# EasyEDA Pro project R标哨兵小周边 v1.1.epro

# Schematic Schematic2
Board Name: 上板; Create Date: 2024-09-23; Page Name: P1; Project Name: 新生培训——pcb入门（装甲板小周边）; Schematic Name: Schematic2; Update Date: 2024-09-23; Company: 嘉立创EDA; Page Size: A4; Version: V1.0
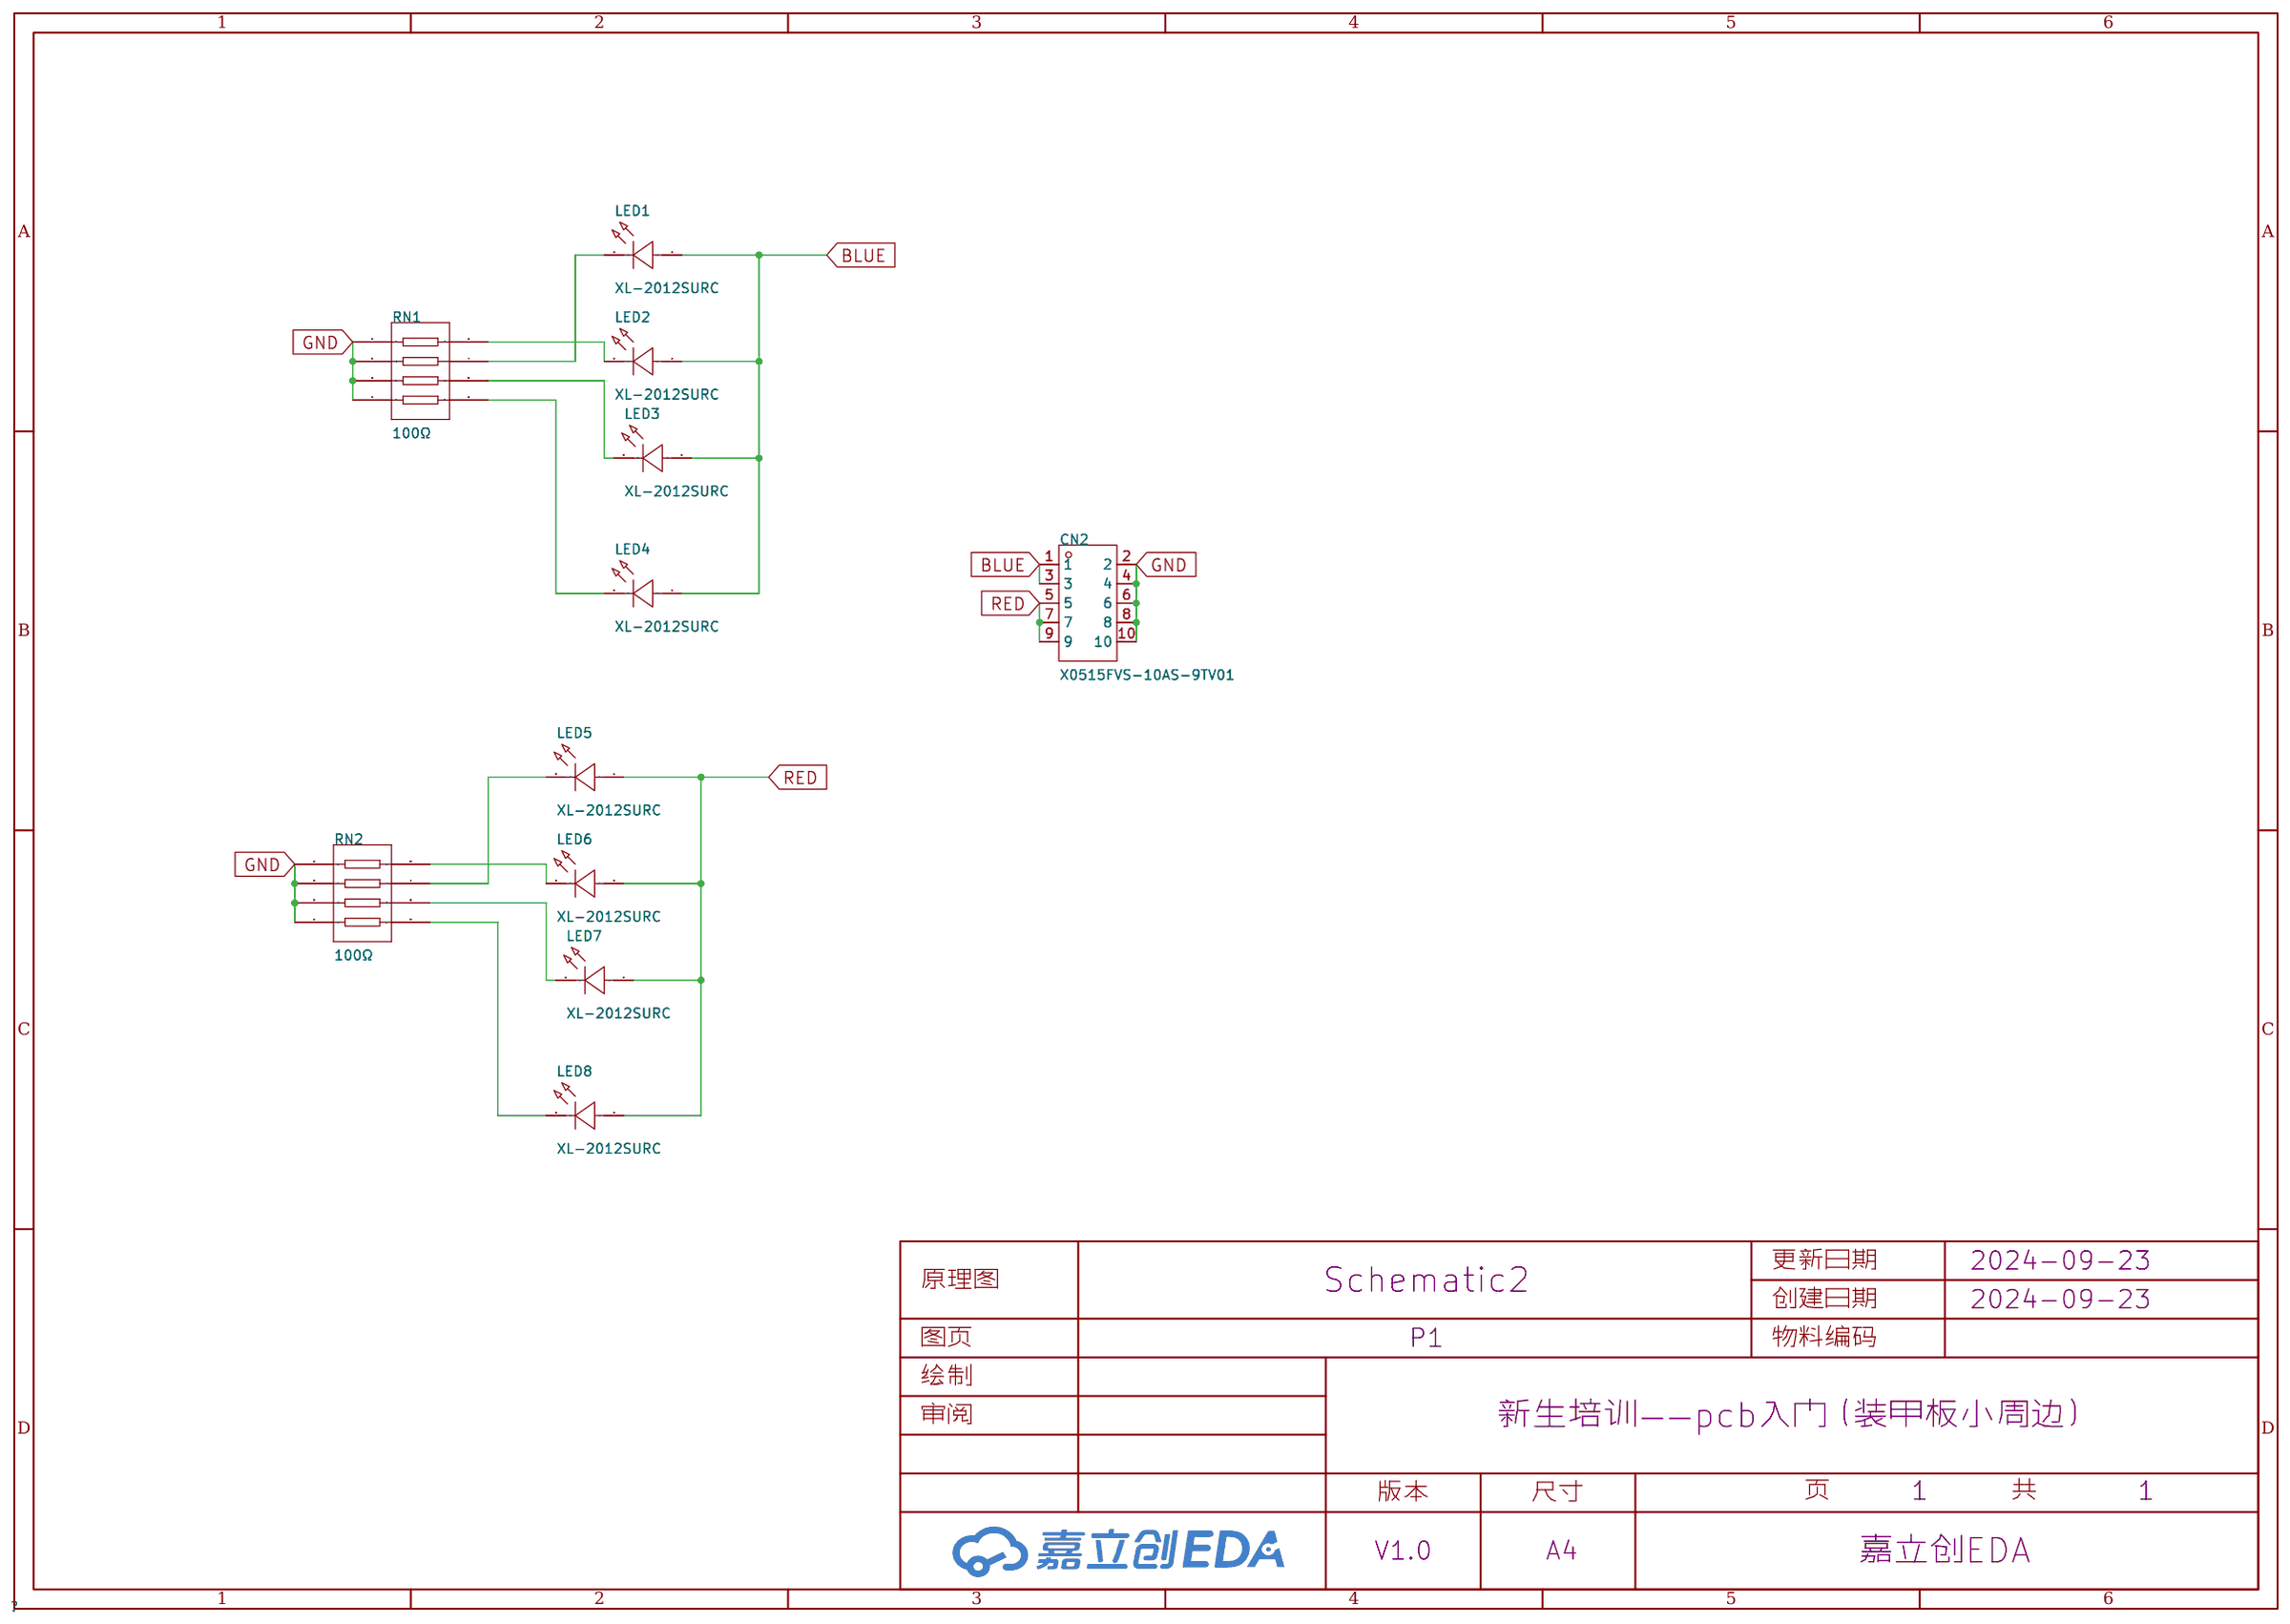
[diagram p0: schematic sheet]

## Parts
CN2  X0515FVS-10AS-9TV01  [CONN-SMD_10P-P0.50_XKB_X0515FVS-10XS-LPV01]
LED1  XL-2012SURC  [LED0805-R-RD]
LED2  XL-2012SURC  [LED0805-R-RD]
LED3  XL-2012SURC  [LED0805-R-RD]
LED4  XL-2012SURC  [LED0805-R-RD]
LED5  XL-2012SURC  [LED0805-R-RD]
LED6  XL-2012SURC  [LED0805-R-RD]
LED7  XL-2012SURC  [LED0805-R-RD]
LED8  XL-2012SURC  [LED0805-R-RD]
RN1  100Ω  [RES-ARRAY-SMD_0603-8P-L3.2-W1.6-BL]
RN2  100Ω  [RES-ARRAY-SMD_0603-8P-L3.2-W1.6-BL]

## Library data of the parts
CN2 = X0515FVS-10AS-9TV01: PIN总数:10P;间距:0.5mm;安装方式:立贴;行数:2;额定电流:300mA;工作温度范围:-25℃~+85℃;; LCSC Part Name: 间距:0.5mm PIN:10P 母 立贴; Supplier Part: C2925347; Manufacturer: XKB Connection(中国星坤); Supplier Footprint: SMD,P=0.5mm; JLCPCB Part Class: 扩展库; Datasheet: https://atta.szlcsc.com/upload/public/pdf/source/20211215/E98E2647E5E212E3F4CD91EF14604315.pdf; Supplier: LCSC; Number of Pins: 10P; Pitch: 0.5mm; Mounting Style: 立贴; Number of Rows: 2; Current Rating (Max): 300mA; Operating Temperature Range: -25℃~+85℃
LED1-LED8 = XL-2012SURC: 发光颜色:红色;功率:55mW;正向电流:25mA;主波长:617nm~621nm;透镜颜色:无色透明透镜;色温:-;发光角度:120°;载带方式:正贴;工作温度:-30℃~+85℃;; Supplier Part: C965812; Manufacturer: XINGLIGHT(成兴光); Supplier Footprint: 0805; JLCPCB Part Class: 扩展库; Datasheet: https://atta.szlcsc.com/upload/public/pdf/source/20221102/49E1A0A365644091E6270AF1C5E0FE37.pdf; Supplier: LCSC; Emitted Color: 红色; Power Dissipation: 55mW; Forward Current: 25mA; Dominant Wavelength: 617nm~621nm; Peak Wavelength: 623nm; Lens Color: 无色透明透镜; Viewing Angle: 120°; Mounting Sytle: 正贴; Operating Temperature: -30℃~+85℃
RN1 RN2 = 4D03WGJ0101T5E: 电阻器数:4;阻值:100Ω;精度:±5%;单个元件功率:62.5mW;温度系数:±200ppm/℃;; LCSC Part Name: 100Ω ±5%; Supplier Part: C25506; Manufacturer: UNI-ROYAL(厚声); Supplier Footprint: 0603x4; JLCPCB Part Class: 扩展库; Datasheet: https://atta.szlcsc.com/upload/public/pdf/source/20191224/C474318_2527498AE30E813171187CCD28401A71.pdf; Supplier: LCSC; Number of Resistors: 4; Tolerance: ±5%; Power(Watts): 62.5mW; Temperature Coefficient: ±200ppm/℃; Number of Pins: 8

## Nets
GND: CN2.2 CN2.4 CN2.6 CN2.8 CN2.10 RN1.1 RN1.2 RN1.3 RN1.4 RN2.1 RN2.2 RN2.3 RN2.4
BLUE: CN2.1 CN2.3 LED1.1(A) LED2.1(A) LED3.1(A) LED4.1(A)
RED: CN2.5 CN2.7 CN2.9 LED5.1(A) LED6.1(A) LED7.1(A) LED8.1(A)
$1N2425: LED3.2(K) RN1.6
$1N2434: LED4.2(K) RN1.5
$1N2703: LED8.2(K) RN2.5
$1N2707: LED7.2(K) RN2.6
$1N2749: LED2.2(K) RN1.8
$1N2754: LED1.2(K) RN1.7
$1N2767: LED6.2(K) RN2.8
$1N2772: LED5.2(K) RN2.7

# Schematic Schematic1
Board Name: 下板; Create Date: 2024-09-08; Page Name: P1; Project Name: 新生培训——pcb入门（装甲板小周边）; Schematic Name: Schematic1; Update Date: 2024-09-27; Company: 嘉立创EDA; Page Size: A4; Version: V1.0
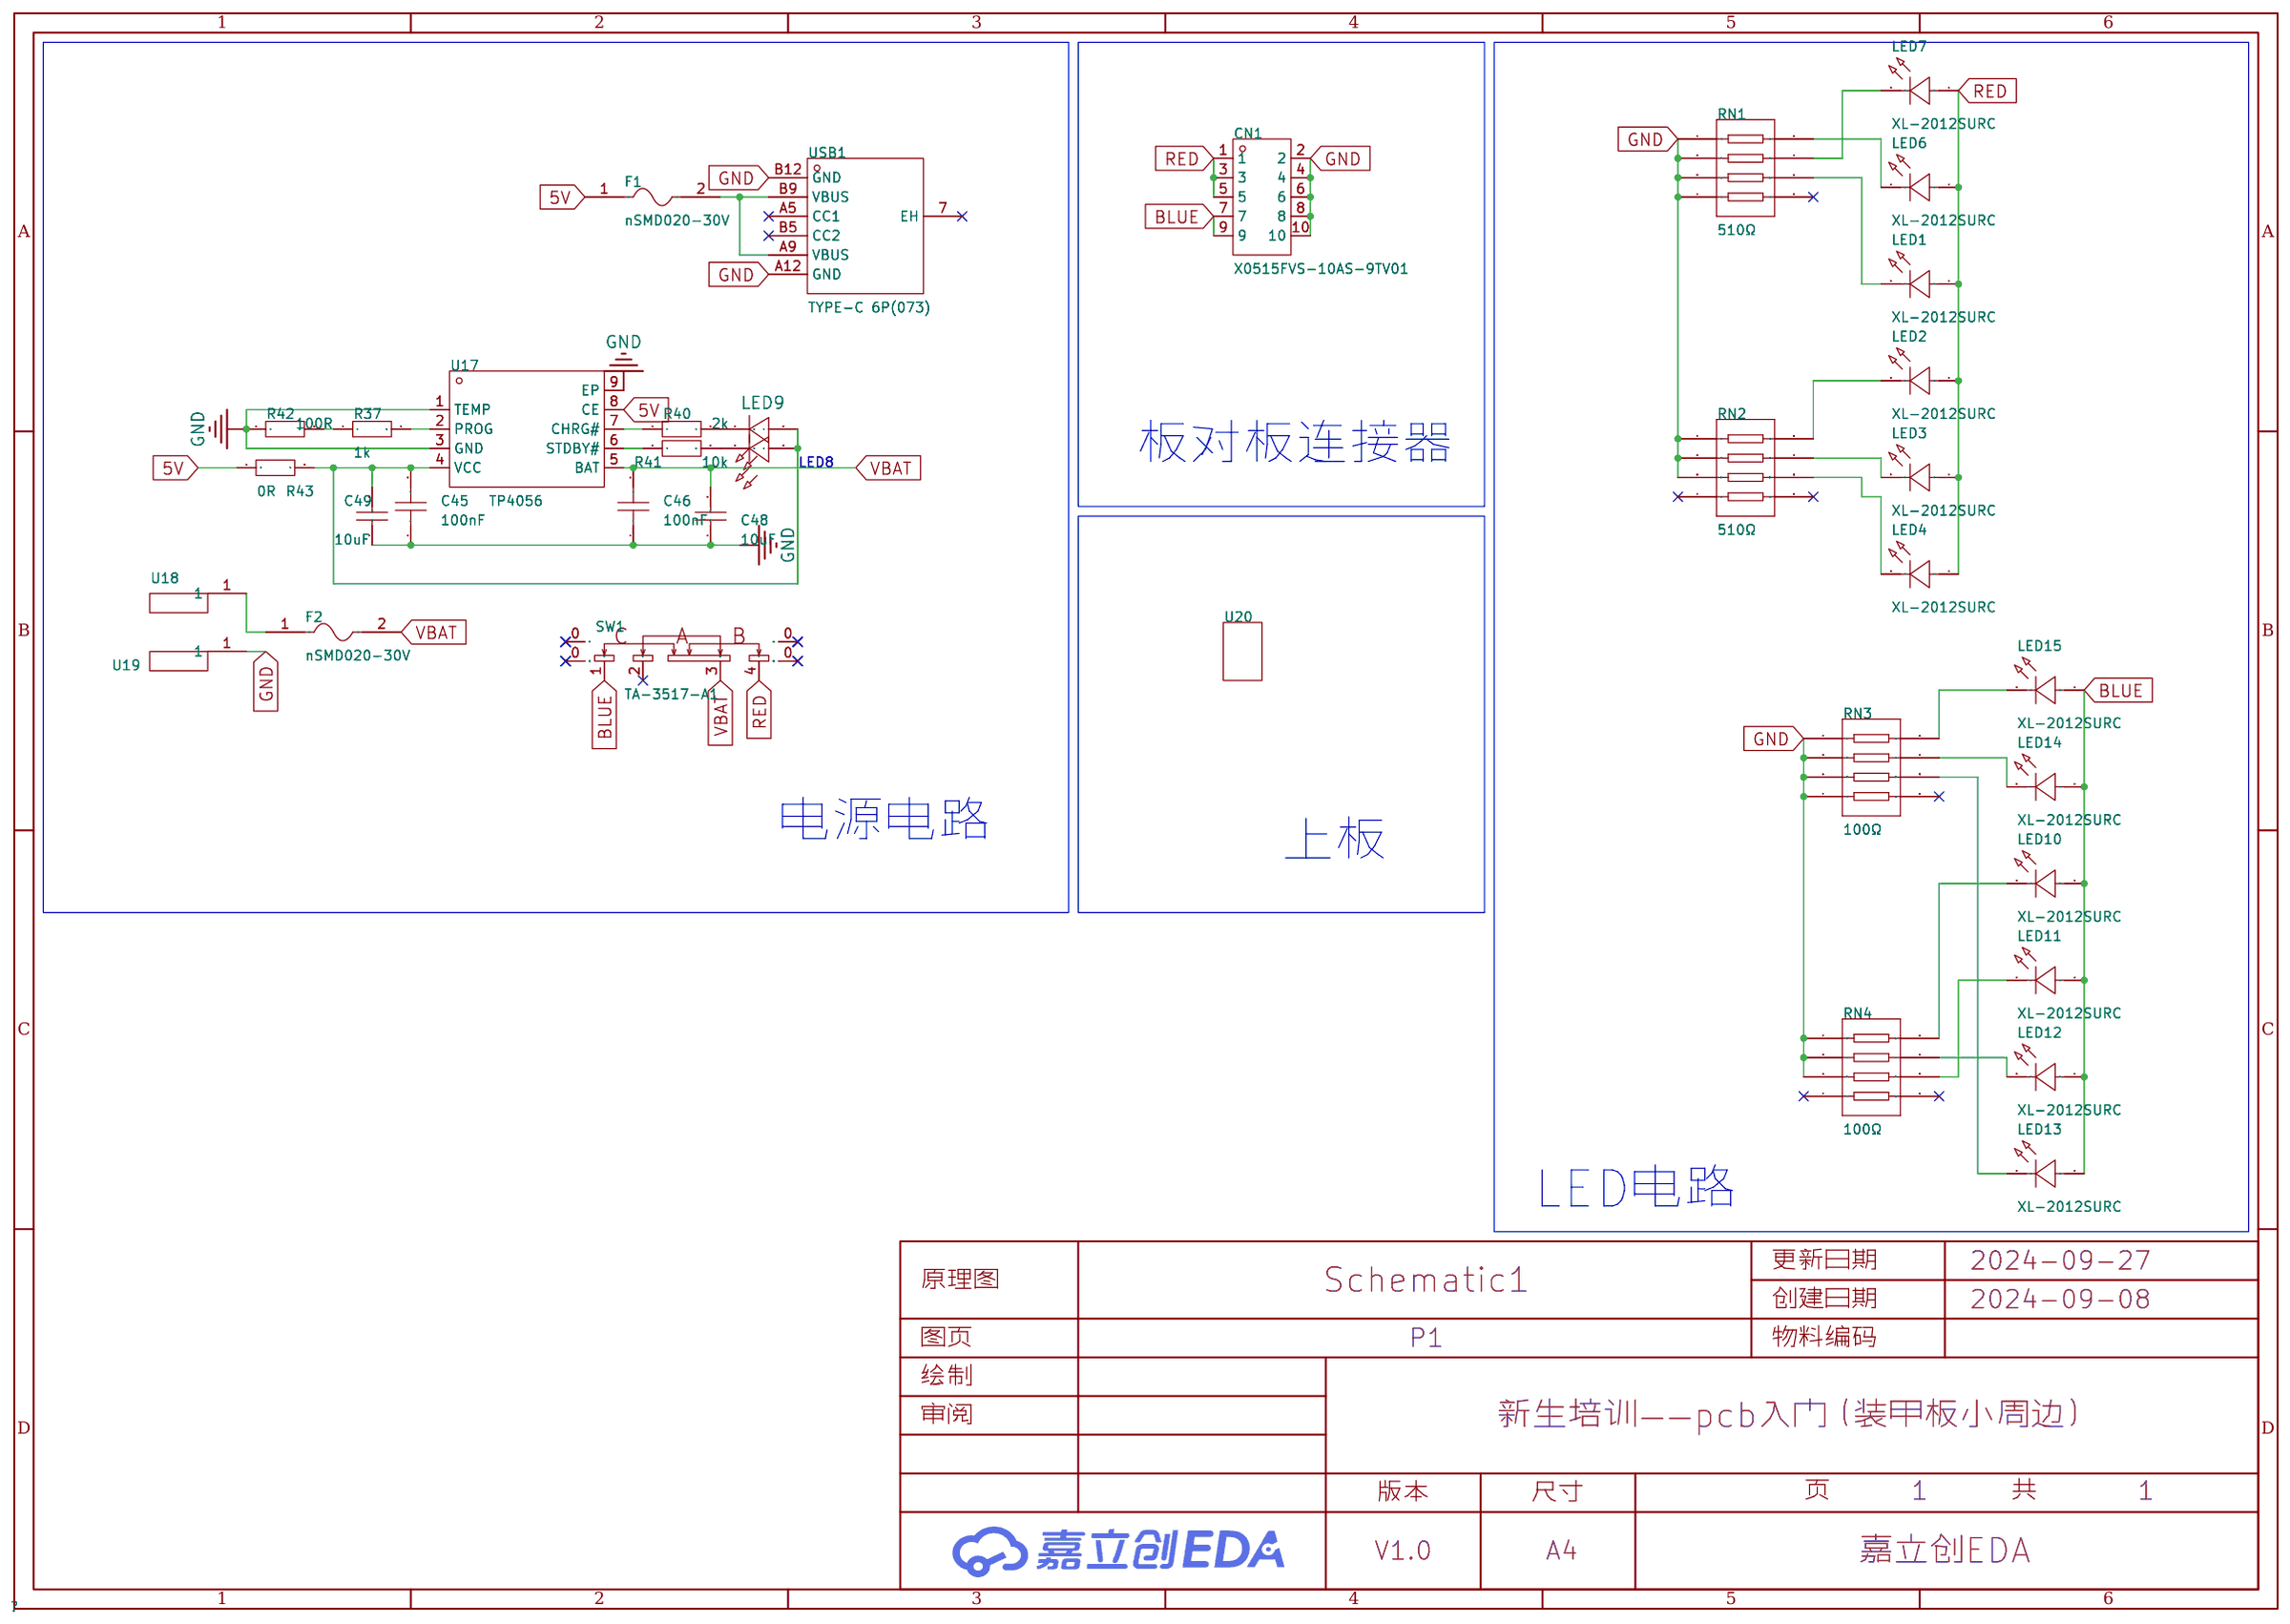
[diagram p1: schematic sheet]

## Parts
C45  100nF  [C0603]
C46  100nF  [C0603]
C48  10uF  [C1206]
C49  10uF  [C0805]
CN1  X0515FVS-10AS-9TV01  [CONN-SMD_10P-P0.50_XKB_X0515FVS-10XS-LPV01]
F1  nSMD020-30V  [F1206]
F2  nSMD020-30V  [F1206]
LED1  XL-2012SURC  [LED0805-R-RD]
LED2  XL-2012SURC  [LED0805-R-RD]
LED3  XL-2012SURC  [LED0805-R-RD]
LED4  XL-2012SURC  [LED0805-R-RD]
LED6  XL-2012SURC  [LED0805-R-RD]
LED7  XL-2012SURC  [LED0805-R-RD]
LED8  -  [LED_0603]
LED9  -  [LED_0603]
LED10  XL-2012SURC  [LED0805-R-RD]
LED11  XL-2012SURC  [LED0805-R-RD]
LED12  XL-2012SURC  [LED0805-R-RD]
LED13  XL-2012SURC  [LED0805-R-RD]
LED14  XL-2012SURC  [LED0805-R-RD]
LED15  XL-2012SURC  [LED0805-R-RD]
R37  1k  [R0603]
R40  2k  [R0603]
R41  10k  [R0603]
R42  100R  [R0603]
R43  0R  [R0603]
RN1  510Ω  [RES-ARRAY-SMD_0603-8P-L3.2-W1.6-BL]
RN2  510Ω  [RES-ARRAY-SMD_0603-8P-L3.2-W1.6-BL]
RN3  100Ω  [RES-ARRAY-SMD_0603-8P-L3.2-W1.6-BL]
RN4  100Ω  [RES-ARRAY-SMD_0603-8P-L3.2-W1.6-BL]
SW1  TA-3517-A1  [SW-SMD_3P-L9.7-W2.7-P1.50-EH5.0]
U17  TP4056  [ESOP-8_L4.9-W3.9-P1.27-LS6.0-BL-EP]
U18  -  [焊盘2*4mm]
U19  -  [焊盘2*4mm]
U20  -  [R标哨兵小周边上板]
USB1  TYPE-C 6P(073)  [TYPE-C-SMD_TYPE-C-6P_5]

## Library data of the parts
C45 C46 = CC0603KRX7R9BB104: 容值:100nF;精度:±10%;额定电压:50V;材质(温度系数):X7R;; LCSC Part Name: 100nF ±10% 50V; Supplier Part: C14663; Manufacturer: YAGEO(国巨); Supplier Footprint: 0603; JLCPCB Part Class: Basic Part; Datasheet: https://atta.szlcsc.com/upload/public/pdf/source/20180910/C282072_33301C7F631E79921B82A8DAC6BCC5B3.pdf; Supplier: LCSC; Tolerance: ±10%; Voltage Rated: 50V; Temperature Coefficient: X7R
C48 = CL31A106KBHNNNE: 容值:10uF;精度:±10%;额定电压:50V;材质(温度系数):X5R;; LCSC Part Name: 10uF ±10% 50V; Supplier Part: C13585; Manufacturer: SAMSUNG(三星); Supplier Footprint: 1206; JLCPCB Part Class: 基础库; Datasheet: https://atta.szlcsc.com/upload/public/pdf/source/20160218/1457707763339.pdf; Supplier: LCSC; Tolerance: ±10%; Voltage Rated: 50V; Temperature Coefficient: X5R
C49 = CL21A106KPFNNNE: 容值:10uF;精度:±10%;额定电压:10V;材质(温度系数):X5R;; LCSC Part Name: 10uF ±10% 10V; Supplier Part: C17024; Manufacturer: SAMSUNG(三星); Supplier Footprint: 0805; JLCPCB Part Class: 扩展库; Datasheet: https://atta.szlcsc.com/upload/public/pdf/source/20160218/1457707763339.pdf; Supplier: LCSC; Tolerance: ±10%; Voltage Rated: 10V; Temperature Coefficient: X5R
CN1 = X0515FVS-10AS-9TV01: PIN总数:10P;间距:0.5mm;安装方式:立贴;行数:2;额定电流:300mA;工作温度范围:-25℃~+85℃;; LCSC Part Name: 间距:0.5mm PIN:10P 母 立贴; Supplier Part: C2925347; Manufacturer: XKB Connection(中国星坤); Supplier Footprint: SMD,P=0.5mm; JLCPCB Part Class: 扩展库; Datasheet: https://atta.szlcsc.com/upload/public/pdf/source/20211215/E98E2647E5E212E3F4CD91EF14604315.pdf; Supplier: LCSC; Number of Pins: 10P; Pitch: 0.5mm; Mounting Style: 立贴; Number of Rows: 2; Current Rating (Max): 300mA; Operating Temperature Range: -25℃~+85℃
F1 F2 = nSMD020-30V: 最大电压:30V;最大电流:100A;保持电流:200mA;跳闸电流:460mA;; LCSC Part Name: 30V 200mA 1206自恢复; Supplier Part: C69680; Manufacturer: 台湾陆海; Supplier Footprint: 1206; JLCPCB Part Class: 扩展库; Datasheet: https://atta.szlcsc.com/upload/public/pdf/source/20230404/9F5B471D89C649BCC2835D46521A6324.pdf; Supplier: LCSC; Operating Voltage (Max): 30V; Current Rating (Max): 100A; Hold Current: 200mA; Trip Current: 460mA
LED1-LED4 LED6 LED7 LED10-LED15 = XL-2012SURC: 发光颜色:红色;功率:55mW;正向电流:25mA;主波长:617nm~621nm;透镜颜色:无色透明透镜;色温:-;发光角度:120°;载带方式:正贴;工作温度:-30℃~+85℃;; Supplier Part: C965812; Manufacturer: XINGLIGHT(成兴光); Supplier Footprint: 0805; JLCPCB Part Class: 扩展库; Datasheet: https://atta.szlcsc.com/upload/public/pdf/source/20221102/49E1A0A365644091E6270AF1C5E0FE37.pdf; Supplier: LCSC; Emitted Color: 红色; Power Dissipation: 55mW; Forward Current: 25mA; Dominant Wavelength: 617nm~621nm; Peak Wavelength: 623nm; Lens Color: 无色透明透镜; Viewing Angle: 120°; Mounting Sytle: 正贴; Operating Temperature: -30℃~+85℃
LED8 = LED_0603-G: Supplier Footprint: 0603
LED9 = LED_0603-R: Supplier Footprint: 0603
R37 R40-R43 = Res_0603: Supplier Footprint: 0603
RN1-RN4 = 4D03WGJ0511T5E: 电阻器数:4;阻值:510Ω;精度:±5%;单个元件功率:62.5mW;温度系数:±200ppm/℃;; LCSC Part Name: 510Ω ±5%; Supplier Part: C25511; Manufacturer: UNI-ROYAL(厚声); Supplier Footprint: 0603x4; JLCPCB Part Class: 扩展库; Datasheet: https://atta.szlcsc.com/upload/public/pdf/source/20191224/C474318_2527498AE30E813171187CCD28401A71.pdf; Supplier: LCSC; Number of Resistors: 4; Tolerance: ±5%; Power(Watts): 62.5mW; Temperature Coefficient: ±200ppm/℃; Number of Pins: 8
SW1 = TA-3517-A1: LCSC Part Name: 滑动开关9.7*2.7*1.5mm贴片侧拨八脚三档; Supplier Part: C514001; Manufacturer: Yuandi(元迪); Supplier Footprint: SMD,2.7x9.7mm; JLCPCB Part Class: 扩展库; Datasheet: https://atta.szlcsc.com/upload/public/pdf/source/20200415/C514001_5675D30F9E25FD0520B13F68A0AD99D2.pdf; Supplier: LCSC
U17 = TP4056_C725790: Supplier Part: C725790; Manufacturer: UMW(友台半导体); Supplier Footprint: ESOP-8; JLCPCB Part Class: 扩展库; Datasheet: https://atta.szlcsc.com/upload/public/pdf/source/20231109/CF74897CE79A500F7FE27A45ADCCC631.pdf; Supplier: LCSC
U18 U19 = 焊盘2*4mm
U20 = R标哨兵小周边上板
USB1 = TYPE-C 6P(073): 连接器类型:Type-C;标准:USB 3.1;公母:母;安装方式:卧贴;触点数量:6P;端口数量:1;额定电流 - 电源:3A;工作温度范围:-25℃~+85℃;; LCSC Part Name: Type-C 母 卧贴; Supplier Part: C668623; Manufacturer: SHOU HAN(首韩); Supplier Footprint: SMD; JLCPCB Part Class: 扩展库; Datasheet: https://atta.szlcsc.com/upload/public/pdf/source/20200618/C668623_A4B260DED7AC1949BAC6AE39E9F4CD80.pdf; Supplier: LCSC; Connector Type: Type-C; Standard: USB 3.1; Gender: 母; Mounting Style: 卧贴; Number of Contacts: 6P; Number of Ports: 1; Current Rating - Power (Max): 3A; Operating Temperature Range: -25℃~+85℃; Rated Voltage (Max): 5V; Connect-Disconnect Life: 1万次; Core Colour: 黑色

## Nets
5V: F1.1 R43.1 U17.8(CE)
GND: C45.1 C46.1 C48.1 C49.1 CN1.2 CN1.4 CN1.6 CN1.8 CN1.10 R42.1 RN1.1 RN1.2 RN1.3 RN1.4 RN2.1 RN2.2 RN2.3 RN3.1 RN3.2 RN3.3 RN3.4 RN4.1 RN4.2 RN4.3 U17.1(TEMP) U17.3(GND) U17.9(EP) U19.1 USB1.A12(GND) USB1.B12(GND)
VBAT: C46.2 C48.2 F2.2 SW1.3 U17.5(BAT)
BLUE: CN1.7 CN1.9 LED10.1(A) LED11.1(A) LED12.1(A) LED13.1(A) LED14.1(A) LED15.1(A) SW1.1
RED: CN1.1 CN1.3 CN1.5 LED1.1(A) LED2.1(A) LED3.1(A) LED4.1(A) LED6.1(A) LED7.1(A) SW1.4
$1N3372: F1.2 USB1.A9(VBUS) USB1.B9(VBUS)
$1N6551: R37.1 R42.2
$1N6554: LED9.1(C) R40.2
$1N6555: LED8.1(C) R41.2
$1N6557: R40.1 U17.7(CHRG#)
$1N6558: R41.1 U17.6(STDBY#)
$1N6562: C45.2 C49.2 LED8.2(A) LED9.2(A) R43.2 U17.4(VCC)
$1N6563: R37.2 U17.2(PROG)
$1N6929: F2.1 U18.1
$1N7346: LED1.2(K) RN1.6
$1N7356: LED2.2(K) RN2.8
$1N7370: LED3.2(K) RN2.7
$1N7376: LED4.2(K) RN2.6
$1N7825: LED12.2(K) RN4.7
$1N7840: LED14.2(K) RN3.7
$1N7843: LED15.2(K) RN3.8
$1N7897: LED6.2(K) RN1.8
$1N7902: LED7.2(K) RN1.7
$1N7924: LED13.2(K) RN3.6
$1N7934: LED11.2(K) RN4.6
$1N7943: LED10.2(K) RN4.8

Not connected (* = marked no-connect by the designer): RN1 5*; RN2 4* 5*; RN3 5*; RN4 4* 5*; SW1 0* 2*; USB1 7(EH)* A5(CC1)* B5(CC2)*

## Notes on the sheet
- 板对板连接器
- 电源电路
- 上板
- LED电路

# Board PCB1
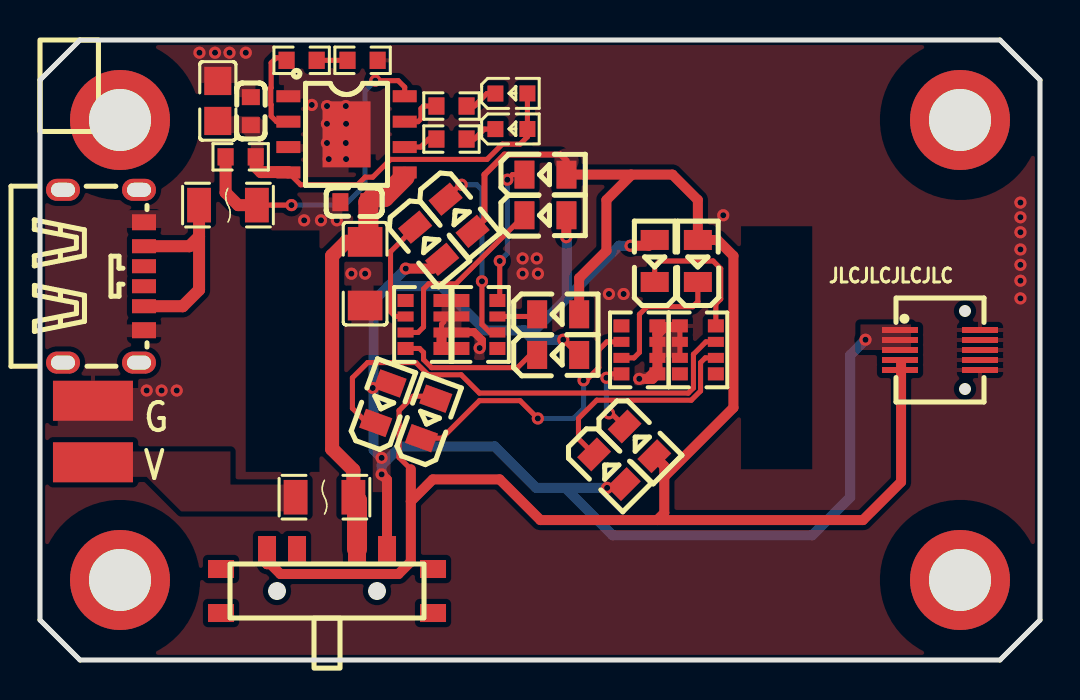
[diagram p2: board, top side]
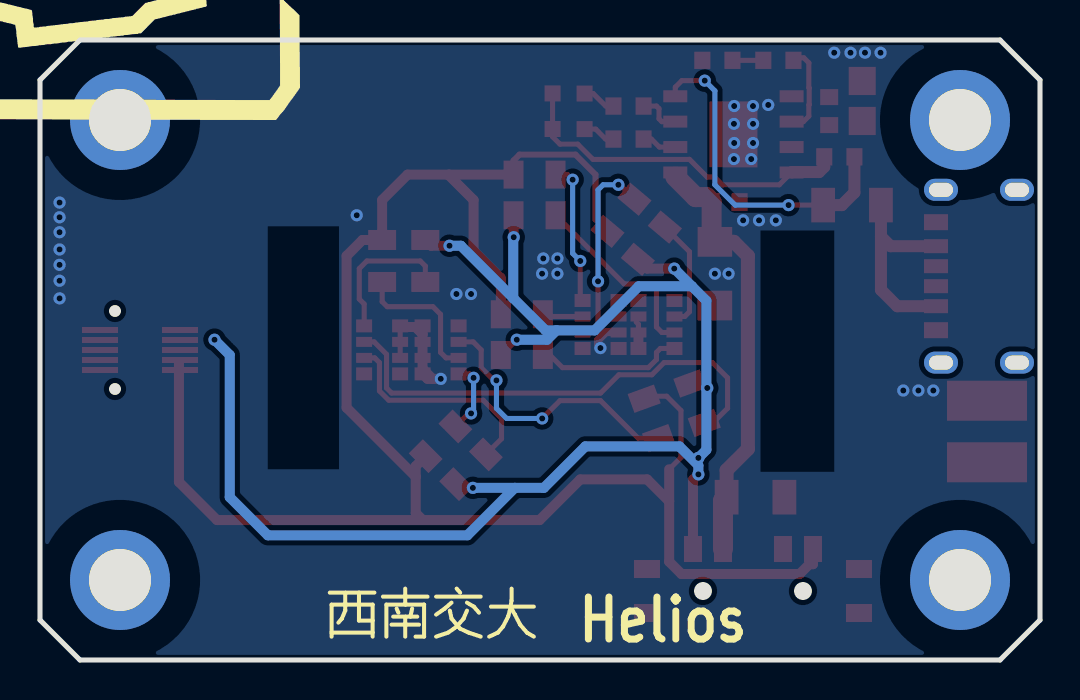
[diagram p3: board, bottom side, seen from below]

Outline 50 x 31 mm; copper layers: Top Layer, Bottom Layer. Coordinates in mm from the lower left corner of the outline.
Outline path: 0,29 0,2 2,0 48,0 50,2 50,29 48,31 2,31 0,29
Stack: Top Layer 0.035mm / Dielectric1 1.51mm FR4 er 4.5 / Bottom Layer 0.035mm

## Design rules (mm)
template: JLCPCB Capability(Two Layers Board)
spacing copperThickness1oz (default): track to track 0.102, other pairs 0.152 to 0.3
spacing copperThickness2oz: track to track 0.203, other pairs 0.152 to 0.3
track width copperThickness1oz (default): min 0.127, default 0.254, max 2.54
track width copperThickness2oz: min 0.203, default 0.254, max 2.54
differential pair differentialPair (default): width min 0.127, default 0.254, max 2.54; gap min 0.152, default 0.152
via viaSize (default): diameter min 0.5, default 0.61, max 10; hole min 0.3, default 0.305, max 6.3

## Placement (name value [footprint] x y rotation side)
C45  100nF  [C0603]  10.54 27.44 270 top
C46  100nF  [C0603]  15.72 22.89 0 top
C48  10uF  [C1206]  16.26 19.32 90 top
C49  10uF  [C0805]  8.89 27.95 270 top
CN1  X0515FVS-10AS-9TV01  [CONN-SMD_10P-P0.50_XKB_X0515FVS-10XS-LPV01]  45 15.5 270 top
F1  nSMD020-30V  [F1206]  9.4 22.74 180 top
F2  nSMD020-30V  [F1206]  14.22 8.14 0 top
LED1  XL-2012SURC  [LED0805-R-RD]  19.43 20.84 310 top
LED2  XL-2012SURC  [LED0805-R-RD]  30.73 19.95 90 top
LED3  XL-2012SURC  [LED0805-R-RD]  17.15 12.84 70 top
LED4  XL-2012SURC  [LED0805-R-RD]  28.45 9.54 315 top
LED6  XL-2012SURC  [LED0805-R-RD]  25.91 15.25 0 top
LED7  XL-2012SURC  [LED0805-R-RD]  25.27 22.24 0 top
LED8  -  [LED_0603]  23.62 26.55 0 top
LED9  -  [LED_0603]  23.62 28.33 0 top
LED10  XL-2012SURC  [LED0805-R-RD]  25.27 24.27 0 top
LED11  XL-2012SURC  [LED0805-R-RD]  20.96 22.24 310 top
LED12  XL-2012SURC  [LED0805-R-RD]  25.91 17.28 0 top
LED13  XL-2012SURC  [LED0805-R-RD]  19.43 12.08 70 top
LED14  XL-2012SURC  [LED0805-R-RD]  32.89 19.95 90 top
LED15  XL-2012SURC  [LED0805-R-RD]  29.97 10.93 315 top
NOREF  -  [Pad_e50]  46 4 0 top
NOREF#2  -  [Pad_e49]  4 4 0 top
NOREF#3  -  [Pad_e46]  4 27 0 top
NOREF#4  -  [Pad_e48]  46 27 0 top
R37  1k  [R0603]  13.08 29.98 180 top
R40  2k  [R0603]  20.57 27.7 0 top
R41  10k  [R0603]  20.57 26.05 0 top
R42  100R  [R0603]  16.13 29.98 180 top
R43  0R  [R0603]  10.03 25.16 0 top
RN1  510Ω  [RES-ARRAY-SMD_0603-8P-L3.2-W1.6-BL]  19.18 16.78 90 top
RN2  510Ω  [RES-ARRAY-SMD_0603-8P-L3.2-W1.6-BL]  32.89 15.51 270 top
RN3  100Ω  [RES-ARRAY-SMD_0603-8P-L3.2-W1.6-BL]  29.97 15.51 90 top
RN4  100Ω  [RES-ARRAY-SMD_0603-8P-L3.2-W1.6-BL]  21.97 16.78 270 top
SW1  TA-3517-A1  [SW-SMD_3P-L9.7-W2.7-P1.50-EH5.0]  14.35 3.95 0 top
U17  TP4056  [ESOP-8_L4.9-W3.9-P1.27-LS6.0-BL-EP]  15.33 26.28 270 top
U18  -  [焊盘2*4mm]  2.65 9.89 90 top
U19  -  [焊盘2*4mm]  2.65 12.96 90 top
U20  -  [R标哨兵小周边上板]  0 31 0 top
USB1  TYPE-C 6P(073)  [TYPE-C-SMD_TYPE-C-6P_5]  3.17 19.19 270 top

## Footprints (pads in the part's own frame, mm; a bottom-side part is the same pattern mirrored in y, then rotated)
C0603
  rect 0.8x0.9 smd: 1(-0.7,0) 2(0.7,0)
C0805
  rect 1.41x1.35 smd: 1(-1,0) 2(1,0)
C1206
  rect 1.485x1.728 smd: 1(-1.593,0) 2(1.593,0)
CONN-SMD_10P-P0.50_XKB_X0515FVS-10XS-LPV01
  rect 0.3x1.8 smd: 1(-1,-2) 2(-1,2) 3(-0.5,-2) 4(-0.5,2) 5(0,-2) 6(0,2) 7(0.5,-2) 8(0.5,2) 9(1,-2) 10(1,2)
ESOP-8_L4.9-W3.9-P1.27-LS6.0-BL-EP
  rect 0.6x1.2 smd: 1(-1.905,-2.909) 2(-0.635,-2.909) 3(0.635,-2.909) 4(1.905,-2.909) 5(1.905,2.909) 6(0.635,2.909) 7(-0.635,2.909) 8(-1.905,2.909)
  rect 3.3x2.4 smd: 9(0,0)
F1206
  rect 1.19x1.728 smd: 1(-1.445,0) 2(1.445,0)
LED0805-R-RD
  rect 1x1.399 smd: 1(1.05,0) 2(-1.05,0)
LED_0603
  rect 0.8x0.8 smd: 1(-0.851,-0.01) 2(0.75,-0.005)
Pad_e46
  round 5 hole 3.1: 1(0,0)
Pad_e48
  round 5 hole 3.1: 1(0,0)
Pad_e49
  round 5 hole 3.1: 1(0,0)
Pad_e50
  round 5 hole 3.1: 1(0,0)
R0603
  rect 0.806x0.864 smd: 1(-0.753,0) 2(0.753,0)
RES-ARRAY-SMD_0603-8P-L3.2-W1.6-BL
  rect 0.65x0.8 smd: 1(-1.2,-0.9) 4(1.2,-0.9) 5(1.2,0.9) 8(-1.2,0.9)
  rect 0.5x0.8 smd: 2(-0.4,-0.9) 3(0.4,-0.9) 6(0.4,0.9) 7(-0.4,0.9)
SW-SMD_3P-L9.7-W2.7-P1.50-EH5.0
  rect 1.3x0.9 smd: 0(-5.3,0.6) 0(-5.3,-1.6) 0(5.3,0.6) 0(5.3,-1.6)
  rect 0.9x1.3 smd: 1(-3,1.6) 2(-1.5,1.6) 3(1.5,1.6) 4(3,1.6)
TYPE-C-SMD_TYPE-C-6P_5
  oval 1.1x1.7 hole 0.7x1.2: 7(-4.32,1.775) 7(-4.32,-2.025) 7(4.32,1.775) 7(4.32,-2.025)
  rect 0.7x1.2 smd: A5(-0.5,2.025) A9(1.5,2.025) B5(0.5,2.025) B9(-1.5,2.025)
  rect 0.8x1.2 smd: A12(2.7,2.025) B12(-2.7,2.025)
焊盘2*4mm
  rect 2x4 smd: 1(0,0)

## Nets
As in the schematic.

Pads without a net: NOREF 1; NOREF#2 1; NOREF#3 1; NOREF#4 1; RN1 5; RN2 4 5; RN3 5; RN4 4 5; SW1 0 2; USB1 7 A5 B5

## Via types
v1: diameter 0.61, hole 0.305, Top Layer to Bottom Layer, 56 vias

## Routing (per net, layer and track width the routed paths; a pad name or vN(x,y) marks a point on that pad's centre or on a via; arc(x,y) is an arc through that point)
5V: length 16.9
  Top Layer w0.254: U17.8 18.24,28.64 17.91,28.97 v1(16.76,28.97) ; F1.1 v1(12.57,22.74)
  Top Layer w0.6: R43.1 9.28,23.37 9.91,22.74 F1.1
  Bottom Layer w0.254: v1(12.57,22.74) 15.24,22.74 16.26,23.76 16.26,28.46 v1(16.76,28.97)
GND: length 9.1
  Top Layer w0.254: RN2.3 RN2.2 RN2.1 ; 20.19,16.9 20.08,16.79 RN1.2
  Top Layer w0.4: 21.46,16.39 21.7,16.39 22.1,15.99 22.1,15.72 v1(21.98,15.6)
  Top Layer w0.5: 30.37,14.06 30.87,14.56 RN3.2 RN3.3 30.87,16.29 ; 30.37,14.06 v1(29.96,14.06) ; 30.37,14.06 30.62,14.06 RN3.1 ; 31.75,16.65 31.23,16.65 30.87,16.29 ; 30.87,16.29 RN3.4 ; RN1.1 RN1.2
  vias: v1(5.33,13.47) v1(6.08,13.47) v1(6.84,13.47) v1(7.97,30.36) v1(8.75,30.36) v1(9.48,30.36) v1(10.29,30.36) v1(13.21,21.98) v1(13.59,27.75) v1(14.05,21.98) v1(14.35,27.7) v1(14.35,26.81) v1(14.35,25.85) v1(14.44,25.05) v1(14.84,21.98) v1(15.29,27.7) v1(15.3,26.81) v1(15.29,25.85) v1(15.3,25.05) v1(15.57,19.32) v1(16.26,19.32) v1(24.13,20.08) v1(24.13,19.32) v1(24.84,20.08) v1(24.9,19.32) v1(28.45,18.3) v1(29.18,18.3) v1(34.16,22.24) v1(49.02,22.87) v1(49.02,22.14) v1(49.02,21.39) v1(49.02,20.53) v1(49.02,19.76) v1(49.02,18.96) v1(49.02,18.08)
VBAT: length 21.5
  Top Layer w0.7: 15.67,8.14 15.67,9.49 14.6,10.55 14.6,20.2 15.31,20.91 C48.2
  Top Layer w1: 18.24,24.16 17.22,23.14 16.67,23.14 C46.2 16.42,21.07 C48.2 ; SW1.3 15.85,7.96 15.67,8.14
BLUE: length 94.9
  Top Layer w0.254: 19.92,12.94 19.46,12.94 19.21,13.19 18.67,13.19 17.95,12.47 17.95,10.13 18.54,9.54
  Top Layer w0.3: LED10.1 26.32,24.97 26.02,25.27 23.23,25.27 22.22,24.27 22.22,22.03 LED11.1
  Top Layer w0.5: 31.21,9.16 34.67,12.62 34.67,20.2 33.87,21 LED14.1 32.89,23 31.62,24.27 29.55,24.27 ; 31.21,9.16 31.21,9.69 LED15.1 ; 31.21,9.16 31.21,7.35 30.86,7 ; 29.55,24.27 LED10.1 ; 29.55,24.27 29.55,24.23 28.32,23 28.32,20.46 26.96,19.1 LED12.1 ; 43.05,14.89 43.05,8.9 41.15,7 30.86,7 ; SW1.1 11.35,4.79 11.53,4.79 12.02,4.3 17.93,4.3 18.54,4.92 18.54,7.93 ; 30.86,7 25.02,7 22.99,9.03 19.64,9.03 18.54,7.93 ; 18.54,7.93 18.54,9.54
RED: length 76.9
  Top Layer w0.254: LED6.1 26.92,15.25 v1(26.16,16.01)
  Top Layer w0.5: v1(29.53,20.71) 30.45,20.71 LED2.1 ; SW1.4 17.35,9.01 v1(17.08,9.28) ; v1(26.31,21.14) 26.31,22.23 LED7.1 ; v1(18.29,19.57) 19.64,19.57 LED1.1
  Bottom Layer w0.5: 17.41,18.69 20.06,18.69 22.27,16.48 24.18,16.48 ; 17.41,18.69 16.68,17.96 16.68,10.51 v1(17.08,10.11) ; 17.41,18.69 v1(18.29,19.57) ; 24.18,16.48 24.72,16.48 26.34,18.09 ; 24.18,16.48 24.65,16.01 v1(26.16,16.01) ; 26.34,18.09 28.96,20.71 v1(29.53,20.71) ; 26.34,18.09 26.34,21.12 v1(26.31,21.14) ; 26.26,8.61 v1(28.36,8.61) ; 26.26,8.61 28.63,6.23 38.61,6.23 40.51,8.14 40.51,15.25 v1(41.28,16.01) ; 26.26,8.61 24.81,8.61 22.73,10.68 18.03,10.68 17.08,9.73 v1(17.08,9.28)
  vias: v1(16.64,13.6)
$1N3372: length 10.3
  Top Layer w0.6: USB1.A9 7.14,17.69 7.95,18.51 7.95,21.17 ; 7.95,21.17 F1.2 ; 7.95,21.17 7.47,20.69 USB1.B9
$1N6551: length 1.5
  Top Layer w0.254: R37.1 R42.2
$1N6554: length 1.7
  Top Layer w0.254: LED9.1 22.34,28.32 21.72,27.7 R40.2
$1N6555: length 1.6
  Top Layer w0.254: R41.2 21.72,26.05 22.22,26.55 LED8.1
$1N6557: length 2.2
  Top Layer w0.254: R40.1 19.18,27.7 19.05,27.57 19.05,27.06 18.9,26.92 U17.7
$1N6558: length 1.8
  Top Layer w0.254: R41.1 19.43,26.05 19.03,25.65 U17.6
$1N6562: length 17.6
  Top Layer w0.254: U17.4 13.03,23.76 15.88,23.76 16.26,24.14 16.64,24.14 17.53,25.03 22.35,25.03 23.11,25.79 24,25.79 24.37,26.16 LED8.2 LED9.2
  Top Layer w0.6: R43.2 10.79,24.66 11.05,24.4 12.4,24.4 U17.4
$1N6563: length 4.6
  Top Layer w0.254: U17.2 11.83,26.92 11.56,27.19 11.56,27.75 11.54,27.77 11.54,28.6 11.56,28.62 11.56,29.86 11.81,30.11 12.2,30.11 R37.2
$1N7346: length 5.6
  Top Layer w0.254: 18.28,17.18 17.76,17.18 17.53,17.41 17.53,20.41 LED1.2
$1N7356: length 7.3
  Top Layer w0.254: LED2.2 30.73,19.7 30.99,19.95 33.66,19.95 34.04,19.57 34.04,18.05 33.79,17.8 RN2.8
$1N7370: length 24.3
  Top Layer w0.254: RN2.7 33.29,15.91 32.67,15.28 32.67,13.6 32.42,13.35 21.97,13.35 21.06,14.26 19.41,14.26 18.8,14.87 16.38,14.87 15.62,14.11 15.62,12.58 16.35,11.85 16.91,11.85
$1N7376: length 11.1
  Top Layer w0.254: RN2.6 33.26,15.11 33.03,14.87 33.03,13.45 32.57,12.99 27.84,12.99 26.92,12.08 26.92,11.06 LED4.2
$1N7825: length 2
  Top Layer w0.254: LED12.2 24.75,17.18 RN4.7
$1N7840: length 7.1
  Top Layer w0.254: RN3.7 29.7,15.11 29.97,15.38 29.97,17.28 30.35,17.66 32.64,17.66 32.89,17.92 LED14.2
$1N7843: length 3.7
  Top Layer w0.254: LED15.2 28.58,12.33 v1(28.45,12.33) ; RN3.8 28.52,14.31 v1(28.32,14.11)
  Bottom Layer w0.254: v1(28.32,14.11) 28.32,12.46 v1(28.45,12.33)
$1N7897: length 7.5
  Top Layer w0.254: LED6.2 24.51,15.25 23.88,14.62 19.58,14.62 19.18,15.02 19.18,15.38 18.98,15.58 18.28,15.58
$1N7902: length 9.5
  Top Layer w0.254: 18.28,16.38 18.9,16.38 19.18,16.65 19.18,18.55 19.43,18.81 20.79,18.81 LED7.2
$1N7924: length 14.2
  Top Layer w0.254: v1(24.89,12.08) 24,12.97 21.97,12.97 20.09,11.09 18.94,11.09 ; v1(27.18,13.98) 27.31,13.98 27.94,14.62 27.94,15.51 28.34,15.91 RN3.6
  Bottom Layer w0.254: v1(27.18,13.98) 27.18,12.58 26.67,12.08 v1(24.89,12.08)
$1N7934: length 9.9
  Top Layer w0.254: LED11.2 21,23.76 v1(21.08,23.76) ; v1(22.1,18.93) 22.1,16.78 22.5,16.38 RN4.6
  Bottom Layer w0.254: v1(21.08,23.76) 21.84,23.76 22.1,23.51 v1(22.1,18.93)
$1N7943: length 7.2
  Top Layer w0.254: v1(23.37,24.02) 23.62,24.27 LED10.2 ; v1(22.99,19.95) 22.99,18.09 RN4.8
  Bottom Layer w0.254: v1(22.99,19.95) 23.37,20.33 v1(23.37,24.02)

## Copper pours and planes (outline as drawn; the poured copper is in the pictures)
GND on Top Layer: 0.89,13.6 6.35,13.6 6.35,11.44 0.89,11.44
GND on Top Layer: 13.84,23.13 14.99,23.13 14.99,21.86 13.84,21.86
GND on Top Layer: 30.87,16.71 31.99,16.71 31.99,15.11 30.87,15.11
GND on Top Layer: 7.62,30.36 10.54,30.36 10.54,29.03 7.62,29.03
GND on Top Layer: -3.56,33.16 51.56,33.16 51.56,-1 -3.56,-1
GND on Top Layer: 12.19,29.09 13.46,29.09 13.46,28.08 12.19,28.08
GND on Top Layer: 3.43,22.49 6.48,22.49 6.48,21.6 3.43,21.6
GND on Top Layer: 3.43,16.78 6.48,16.78 6.48,16.14 3.43,16.14
GND on Top Layer: 20.08,17.98 21.07,17.98 21.07,16.38 20.08,16.38
GND on Top Layer: 13.59,25.76 15.29,25.76 15.29,24.33 13.59,24.33
GND on Top Layer: 15.57,19.32 16.68,19.32 16.68,16.13 15.57,16.13
GND on Top Layer: 13.59,28.33 17.02,28.33 17.02,25.28 13.59,25.28
GND on Top Layer: 12.06,25.79 14.86,25.79 14.86,25.41 12.06,25.41
GND on Top Layer: 9.81,30.36 10.77,30.36 10.77,28.14 9.81,28.14
GND on Bottom Layer: -6.35,33.03 53.34,33.03 53.34,-2.53 -6.35,-2.53
RED on Top Layer: 16.64,10.55 17.53,10.55 17.53,8.39 16.64,8.39
RED on Top Layer: 41.02,16.78 43.55,16.78 43.55,15.5 41.02,15.5
$1N6562 on Top Layer: 8.38,27.19 11.18,27.19 11.18,24.71 8.38,24.71
$1N6929 on Top Layer: 2.03,10.43 12.95,10.43 12.95,7.43 2.03,7.43

## Text on the board
Bottom Silkscreen Layer: Helios | 西南交大
Top Silkscreen Layer: JLCJLCJLCJLC | V | G

# Board PCB2
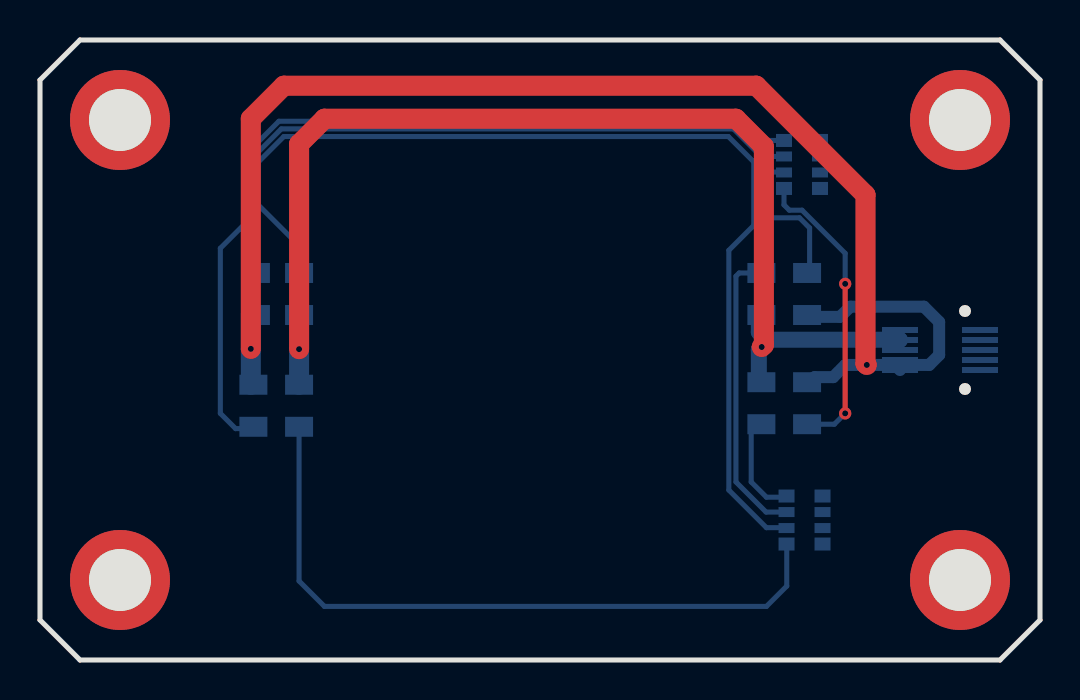
[diagram p4: board, top side]
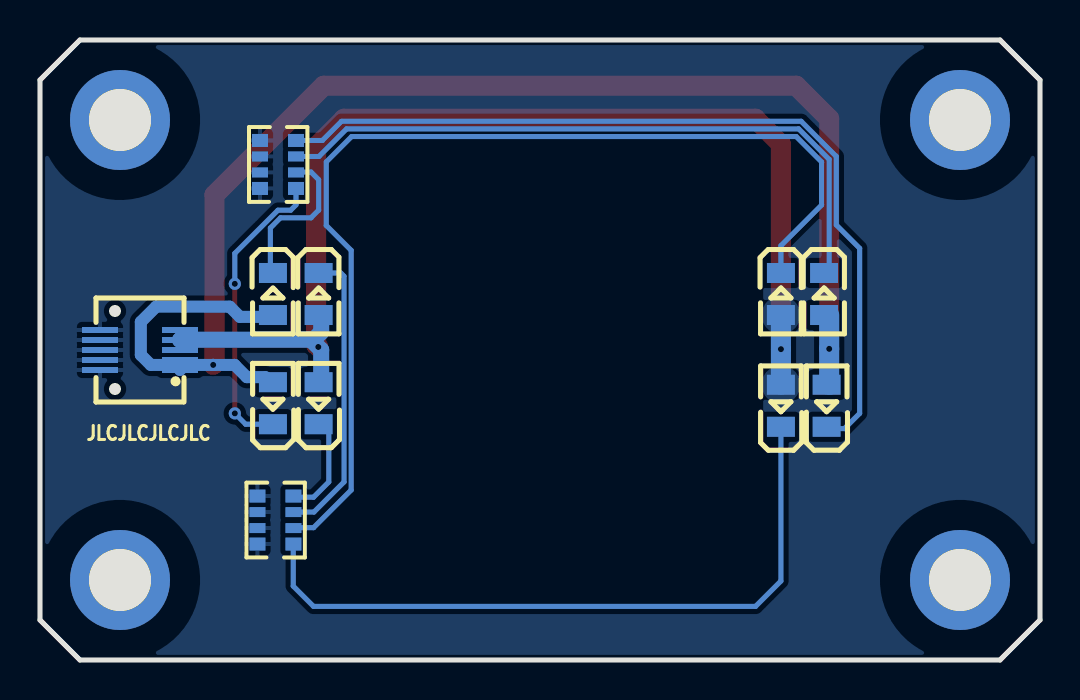
[diagram p5: board, bottom side, seen from below]

Outline 50 x 31 mm; copper layers: Top Layer, Bottom Layer. Coordinates in mm from the lower left corner of the outline.
Outline path: 0,29 0,2 2,0 48,0 50,2 50,29 48,31 2,31 0,29
Stack: Top Layer 0.035mm / Dielectric1 1.51mm FR4 er 4.5 / Bottom Layer 0.035mm

## Design rules (mm)
template: JLCPCB Capability(Two Layers Board)
spacing copperThickness1oz (default): track to track 0.102, other pairs 0.152 to 0.3
spacing copperThickness2oz: track to track 0.203, other pairs 0.152 to 0.3
track width copperThickness1oz (default): min 0.127, default 0.254, max 2.54
track width copperThickness2oz: min 0.203, default 0.254, max 2.54
differential pair differentialPair (default): width min 0.127, default 0.254, max 2.54; gap min 0.152, default 0.152
via viaSize (default): diameter min 0.5, default 0.61, max 10; hole min 0.3, default 0.305, max 6.3

## Placement (name value [footprint] x y rotation side)
CN2  X0515FVS-10AS-9TV01  [CONN-SMD_10P-P0.50_XKB_X0515FVS-10XS-LPV01]  45 15.5 90 bottom
LED1  XL-2012SURC  [LED0805-R-RD]  10.79 18.3 270 bottom
LED2  XL-2012SURC  [LED0805-R-RD]  10.67 12.71 90 bottom
LED3  XL-2012SURC  [LED0805-R-RD]  38.35 18.3 270 bottom
LED4  XL-2012SURC  [LED0805-R-RD]  38.35 12.84 90 bottom
LED5  XL-2012SURC  [LED0805-R-RD]  36.07 18.3 270 bottom
LED6  XL-2012SURC  [LED0805-R-RD]  36.07 12.84 90 bottom
LED7  XL-2012SURC  [LED0805-R-RD]  12.95 18.3 270 bottom
LED8  XL-2012SURC  [LED0805-R-RD]  12.95 12.71 90 bottom
NOREF  -  [Pad_e22]  46 27 0 top
NOREF#2  -  [Pad_e17]  4 27 0 top
NOREF#3  -  [Pad_e23]  46 4 0 top
NOREF#4  -  [Pad_e21]  4 4 0 top
RN1  100Ω  [RES-ARRAY-SMD_0603-8P-L3.2-W1.6-BL]  38.1 24.78 270 bottom
RN2  100Ω  [RES-ARRAY-SMD_0603-8P-L3.2-W1.6-BL]  38.23 7 270 bottom

## Footprints (pads in the part's own frame, mm; a bottom-side part is the same pattern mirrored in y, then rotated)
CONN-SMD_10P-P0.50_XKB_X0515FVS-10XS-LPV01
  rect 0.3x1.8 smd: 1(-1,-2) 2(-1,2) 3(-0.5,-2) 4(-0.5,2) 5(0,-2) 6(0,2) 7(0.5,-2) 8(0.5,2) 9(1,-2) 10(1,2)
LED0805-R-RD
  rect 1x1.399 smd: 1(1.05,0) 2(-1.05,0)
Pad_e17
  round 5 hole 3.1: 1(0,0)
Pad_e21
  round 5 hole 3.1: 1(0,0)
Pad_e22
  round 5 hole 3.1: 1(0,0)
Pad_e23
  round 5 hole 3.1: 1(0,0)
RES-ARRAY-SMD_0603-8P-L3.2-W1.6-BL
  rect 0.65x0.8 smd: 1(-1.2,-0.9) 4(1.2,-0.9) 5(1.2,0.9) 8(-1.2,0.9)
  rect 0.5x0.8 smd: 2(-0.4,-0.9) 3(0.4,-0.9) 6(0.4,0.9) 7(-0.4,0.9)

## Nets
As in the schematic.

Pads without a net: NOREF 1; NOREF#2 1; NOREF#3 1; NOREF#4 1

## Via types
v1: diameter 0.61, hole 0.305, Top Layer to Bottom Layer, 6 vias

## Routing (per net, layer and track width the routed paths; a pad name or vN(x,y) marks a point on that pad's centre or on a via; arc(x,y) is an arc through that point)
BLUE: length 73.3
  Top Layer w1: v1(41.34,14.75) 41.28,14.82 41.28,23.25 35.81,28.71 12.19,28.71 10.54,27.06 v1(10.54,15.56)
  Bottom Layer w0.6: 42.75,14.75 44.46,14.75 44.96,15.25 44.96,16.9 44.2,17.66 40.51,17.66 40,17.16 38.57,17.16 38.48,17.25 ; 42.75,14.75 CN2.1 ; 42.75,14.75 v1(41.34,14.75) 40.27,14.75 39.66,14.14 38.73,14.14 38.48,13.89
  Bottom Layer w1: 10.54,17.25 v1(10.54,15.56) 10.54,13.76
RED: length 58.6
  Top Layer w1: v1(12.95,15.54) 12.95,25.79 14.22,27.06 34.8,27.06 36.19,25.67 36.19,15.76 v1(36.09,15.65)
  Bottom Layer w0.8: 35.94,17.25 35.94,16.39 36.32,16.01 36.45,16.01 ; 35.94,13.89 35.94,15.51 36.45,16.01 ; 36.45,16.01 42.99,16.01 CN2.7
  Bottom Layer w1: LED8.1 v1(12.95,15.54) LED7.1
$1N2425: length 7.9
  Bottom Layer w0.254: RN1.6 37.18,24.4 36.45,24.4 36.07,24.01 36.07,22.49 36.45,22.11 37.97,22.11 38.48,21.6 38.48,19.35
$1N2434: length 14.9
  Top Layer w0.254: v1(40.26,18.81) v1(40.26,12.33)
  Bottom Layer w0.254: v1(40.26,18.81) 40.26,20.33 38.1,22.49 37.47,22.49 37.2,22.76 RN1.5 ; v1(40.26,12.33) 39.72,11.79 38.48,11.79
$1N2703: length 35.1
  Bottom Layer w0.254: RN2.5 37.34,5.79 37.34,3.69 36.32,2.68 14.22,2.68 12.95,3.95 LED8.2
$1N2707: length 52.8
  Bottom Layer w0.254: RN2.6 37.31,6.62 36.32,6.62 34.44,8.5 34.44,20.48 35.69,21.73 35.69,24.9 34.42,26.17 12.19,26.17 10.92,24.9 10.92,22.74 12.95,20.71 LED7.2
$1N2749: length 43.3
  Bottom Layer w0.254: RN1.8 35.88,25.98 34.92,26.94 11.94,26.94 10.19,25.18 10.19,21.75 9.02,20.59 9.02,12.33 9.78,11.57 10.45,11.57 10.54,11.66
$1N2754: length 33.5
  Bottom Layer w0.254: 10.54,19.35 10.54,25.03 12.06,26.55 34.67,26.55 36.05,25.18 RN1.7
$1N2767: length 5.2
  Bottom Layer w0.254: 35.94,11.79 35.56,11.41 35.56,8.9 36.32,8.14 37.27,8.14 37.33,8.2
$1N2772: length 14.6
  Bottom Layer w0.254: 37.33,7.4 36.3,7.4 34.8,8.9 34.8,19.19 34.96,19.35 35.94,19.35

## Copper pours and planes (outline as drawn; the poured copper is in the pictures)
GND on Bottom Layer: -3.68,33.29 54.48,33.29 54.48,-5.32 -3.68,-5.32

## Text on the board
Bottom Silkscreen Layer: JLCJLCJLCJLC
